# EAGLE design Placa ATMEL 2019 v2.4 (EAGLE 7.6.0)
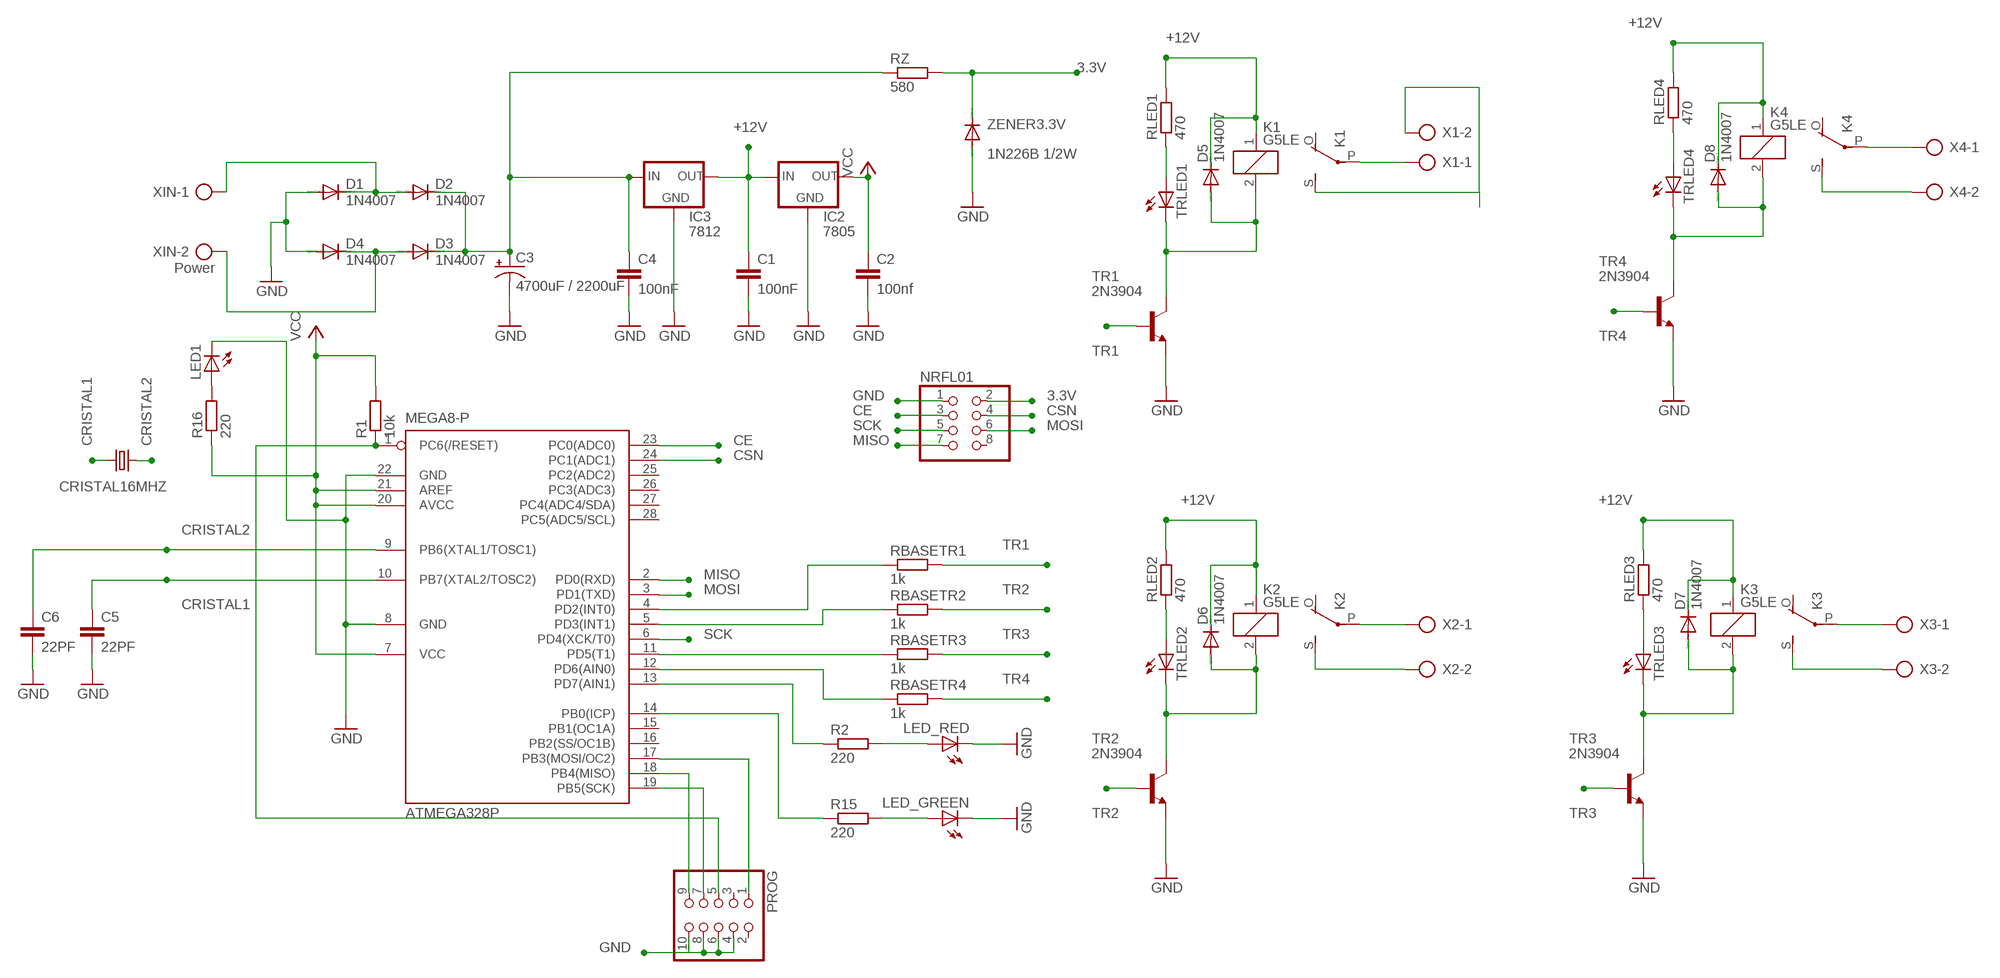
[diagram p0: schematic, sheet 1]

## Parts
ATMEGA328P  MEGA8-P  [DIL28-3]
C1  100nF  C-EU050-025X075  [C050-025X075]
C2  100nf  C-EU050-025X075  [C050-025X075]
C3  4700uF / 2200uF  CPOL-USE7.5-16  [E7,5-16]
C4  100nF  C-EU050-025X075  [C050-025X075]
C5  22PF  C-EU050-024X044  [C050-024X044]
C6  22PF  C-EU050-024X044  [C050-024X044]
CRISTAL16MHZ  CRYSTALHC49S  [HC49/S]
D1  1N4007  1N4004  [DO41-10]
D2  1N4007  1N4004  [DO41-10]
D3  1N4007  1N4004  [DO41-10]
D4  1N4007  1N4004  [DO41-10]
D5  1N4007  1N4004  [DO41-10]
D6  1N4007  1N4004  [DO41-10]
D7  1N4007  1N4004  [DO41-10]
D8  1N4007  1N4004  [DO41-10]
IC2  7805  78XXL  [78XXL]
IC3  7812  78XXL  [78XXL]
K1  G5LE  [G5LE]
K2  G5LE  [G5LE]
K3  G5LE  [G5LE]
K4  G5LE  [G5LE]
LED1  LED5MM  [LED5MM]
LED_GREEN  LED5MM  [LED5MM]
LED_RED  LED5MM  [LED5MM]
NRFL01  PINHD-2X4  [2X04]
PROG  PINHD-2X5  [2X05]
R1  10k  R-EU_0207/10  [0207/10]
R2  220  R-EU_0207/10  [0207/10]
R15  220  R-EU_0207/10  [0207/10]
R16  220  R-EU_0309/10  [0309/10]
RBASETR1  1k  R-EU_0207/10  [0207/10]
RBASETR2  1k  R-EU_0207/10  [0207/10]
RBASETR3  1k  R-EU_0204/7  [0204/7]
RBASETR4  1k  R-EU_0207/15  [0207/15]
RLED1  470  R-EU_0207/10  [0207/10]
RLED2  470  R-EU_0207/10  [0207/10]
RLED3  470  R-EU_0207/10  [0207/10]
RLED4  470  R-EU_0207/10  [0207/10]
RZ  580  R-EU_0207/10  [0207/10]
TR1  2N3904  [TO92]
TR2  2N3904  [TO92]
TR3  2N3904  [TO92]
TR4  2N3904  [TO92]
TRLED1  LED5MM  [LED5MM]
TRLED2  LED5MM  [LED5MM]
TRLED3  LED5MM  [LED5MM]
TRLED4  LED5MM  [LED5MM]
X1  AK300/2  [AK300/2]
X2  AK300/2  [AK300/2]
X3  AK300/2  [AK300/2]
X4  AK300/2  [AK300/2]
XIN  Power  AK500/2  [AK500/2]
ZENER3.3V  1N226B 1/2W  1N4148DO35-10  [DO35-10]

## Nets
3.3V: NRFL01.2 RZ.2 ZENER3.3V.C
+12V: C1.1 D5.C D6.C D7.C D8.C IC2.IN IC3.OUT K1.1 K2.1 K3.1 K4.1 RLED1.2 RLED2.2 RLED3.2 RLED4.2
CE: ATMEGA328P.23(PC0(ADC0)) NRFL01.3
CRISTAL1: ATMEGA328P.10(PB7(XTAL2/TOSC2)) C5.1 CRISTAL16MHZ.2
CRISTAL2: ATMEGA328P.9(PB6(XTAL1/TOSC1)) C6.1 CRISTAL16MHZ.1
CSN: ATMEGA328P.24(PC1(ADC1)) NRFL01.4
GND: ATMEGA328P.8(GND) ATMEGA328P.22(GND) C1.2 C2.2 C3.- C4.2 C5.2 C6.2 D1.A D4.A IC2.GND IC3.GND LED1.K(C) LED_GREEN.K(C) LED_RED.K(C) NRFL01.1 PROG.4 PROG.6 PROG.8 PROG.10 TR1.3(E) TR2.3(E) TR3.3(E) TR4.3(E) ZENER3.3V.A
MISO: ATMEGA328P.2(PD0(RXD)) NRFL01.7
MOSI: ATMEGA328P.3(PD1(TXD)) NRFL01.6
N$1: ATMEGA328P.1(PC6(/RESET)) PROG.5 R1.1
N$2: LED_RED.A R2.2
N$3: ATMEGA328P.14(PB0(ICP)) R15.1
N$4: ATMEGA328P.13(PD7(AIN1)) R2.1
N$6: RLED1.1 TRLED1.A
N$7: ATMEGA328P.4(PD2(INT0)) RBASETR1.1
N$8: ATMEGA328P.5(PD3(INT1)) RBASETR2.1
N$10: ATMEGA328P.11(PD5(T1)) RBASETR3.1
N$12: ATMEGA328P.12(PD6(AIN0)) RBASETR4.1
N$16: ATMEGA328P.17(PB3(MOSI/OC2)) PROG.1
N$17: LED1.A R16.2
N$18: ATMEGA328P.19(PB5(SCK)) PROG.7
N$19: ATMEGA328P.18(PB4(MISO)) PROG.9
N$22: C3.+ C4.1 D2.C D3.C IC3.IN RZ.1
N$24: D1.C D2.A XIN.1
N$29: D5.A K1.2 TR1.1(C) TRLED1.K(C)
N$31: K1.S(2:S) X1.2
N$32: K1.P(2:P) X1.1
N$65: D3.A D4.C XIN.2
N$71: RLED2.1 TRLED2.A
N$81: D6.A K2.2 TR2.1(C) TRLED2.K(C)
N$83: K2.S(2:S) X2.2
N$84: K2.P(2:P) X2.1
N$85: RLED3.1 TRLED3.A
N$86: D7.A K3.2 TR3.1(C) TRLED3.K(C)
N$88: K3.S(2:S) X3.2
N$89: K3.P(2:P) X3.1
N$118: RLED4.1 TRLED4.A
N$138: D8.A K4.2 TR4.1(C) TRLED4.K(C)
N$147: K4.S(2:S) X4.2
N$148: K4.P(2:P) X4.1
N$153: LED_GREEN.A R15.2
SCK: ATMEGA328P.6(PD4(XCK/T0)) NRFL01.5
TR1: RBASETR1.2 TR1.2(B)
TR2: RBASETR2.2 TR2.2(B)
TR3: RBASETR3.2 TR3.2(B)
TR4: RBASETR4.2 TR4.2(B)
VCC: ATMEGA328P.7(VCC) ATMEGA328P.20(AVCC) ATMEGA328P.21(AREF) C2.1 IC2.OUT R1.2 R16.1
Unconnected: ATMEGA328P.15(PB1(OC1A)) ATMEGA328P.16(PB2(SS/OC1B)) ATMEGA328P.25(PC2(ADC2)) ATMEGA328P.26(PC3(ADC3)) ATMEGA328P.27(PC4(ADC4/SDA)) ATMEGA328P.28(PC5(ADC5/SCL)) K1.O(2:O) K2.O(2:O) K3.O(2:O) K4.O(2:O) NRFL01.8 PROG.2 PROG.3

## Library data of the parts
ATMEGA328P = atmel:MEGA8-P: MICROCONTROLLER 8 Kbytes FLASH, 1 kbytes SRAM, 512 bytes EEPROM, USART, 4-channel 10 bit ADC, 2-channel 8 bit ADC Pin compatible with Atmega48, ATMega88, ATMega168 Source: avr.lbr; OC_FARNELL: unknown; OC_NEWARK: unknown
C1 C2 C4-C6 = rcl:C-EU: CAPACITOR, European symbol
C3 = rcl:CPOL-US: POLARIZED CAPACITOR, American symbol
CRISTAL16MHZ = crystal:CRYSTAL: CRYSTAL; OC_FARNELL: 1667008; OC_NEWARK: unknown
D1-D8 = diode:1N4004: DIODE general purpose rectifier, 1 A
IC2 IC3 = v-reg:78XXL: VOLTAGE REGULATOR
K1-K4 = relay:G5LE: RELAY 1 x switch, 10 A/120 V AC, 8 A/30 V DC, Omron; OC_FARNELL: unknown; OC_NEWARK: unknown
LED1 LED_GREEN LED_RED TRLED1-TRLED4 = led:LED: LED OSRAM: - CHIPLED LG R971, LG N971, LY N971, LG Q971, LY Q971, LO R971, LY R971 LH N974, LH R974 LS Q976, LO Q976, LY Q976 LO Q996 - Hyper CHIPLED LW Q18S LB Q993, LB Q99A, LB R99A - SideLED LS A670, LO A670, LY A670, LG A670, LP A670 LB A673, LV A673, LT A673, LW A673 LH A674 LY A675 LS A676, LA A676, LO A676, LY A676, LW A676 LS A679, LY A679, LG A679 - Hyper Micro SIDELED® LS Y876, LA Y876, LO Y876, LY Y876 LT Y87S - SmartLED LW L88C, LW L88S LB L89C, LB L89S, LG L890 LS L89K, LO L89K, LY L89K LS L896, LA L896, LO L896, LY L896 - TOPLED LS T670, LO T670, LY T670, LG T670, LP T670 LSG T670, LSP T670, LSY T670, LOP T670, LYG T670 LG T671, LOG T671, LSG T671 LB T673, LV T673, LT T673, LW T673 LH T674 LS T676, LA T676, LO T676, LY T676, LB T676, LH T676, LSB T676, LW T676 LB T67C, LV T67C, LT T67C, LS T67K, LO T67K, LY T67K, LW E67C LS E67B, LA E67B, LO E67B, LY E67B, LB E67C, LV E67C, LT E67C LW T67C LS T679, LY T679, LG T679 LS T770, LO T770, LY T770, LG T770, LP T770 LB T773, LV T773, LT T773, LW T773 LH T774 LS E675, LA E675, LY E675, LS T675 LS T776, LA T776, LO T776, LY T776, LB T776 LHGB T686 LT T68C, LB T68C - Hyper Mini TOPLED® LB M676 - Mini TOPLED Santana® LG M470 LS M47K, LO M47K, LY M47K Source: http://www.osram.convergy.de LUXEON: - LUMILED® LXK2-PW12-R00, LXK2-PW12-S00, LXK2-PW14-U00, LXK2-PW14-V00 LXK2-PM12-R00, LXK2-PM12-S00, LXK2-PM14-U00 LXK2-PE12-Q00, LXK2-PE12-R00, LXK2-PE12-S00, LXK2-PE14-T00, LXK2-PE14-U00 LXK2-PB12-K00, LXK2-PB12-L00, LXK2-PB12-M00, LXK2-PB14-N00, LXK2-PB14-P00, LXK2-PB14-Q00 LXK2-PR12-L00, LXK2-PR12-M00, LXK2-PR14-Q00, LXK2-PR14-R00 LXK2-PD12-Q00, LXK2-PD12-R00, LXK2-PD12-S00 LXK2-PH12-R00, LXK2-PH12-S00 LXK2-PL12-P00, LXK2-PL12-Q00, LXK2-PL12-R00 Source: www.luxeon.com KINGBRIGHT: KA-3528ASYC Source: www.kingbright.com
NRFL01 = pinhead:PINHD-2X4: PIN HEADER
PROG = pinhead:PINHD-2X5: PIN HEADER
R1 R2 R15 R16 RBASETR1-RBASETR4 RLED1-RLED4 RZ = rcl:R-EU_: RESISTOR, European symbol
TR1-TR4 = transistor-npn:2N3904: NPN Transistor
X1-X4 = con-ptr500:AK300/2: CONNECTOR; OC_FARNELL: unknown; OC_NEWARK: unknown
XIN = con-ptr500:AK500/2: CONNECTOR; OC_FARNELL: unknown; OC_NEWARK: unknown
ZENER3.3V = diode:1N4148: DIODE high speed (Philips)

## Board
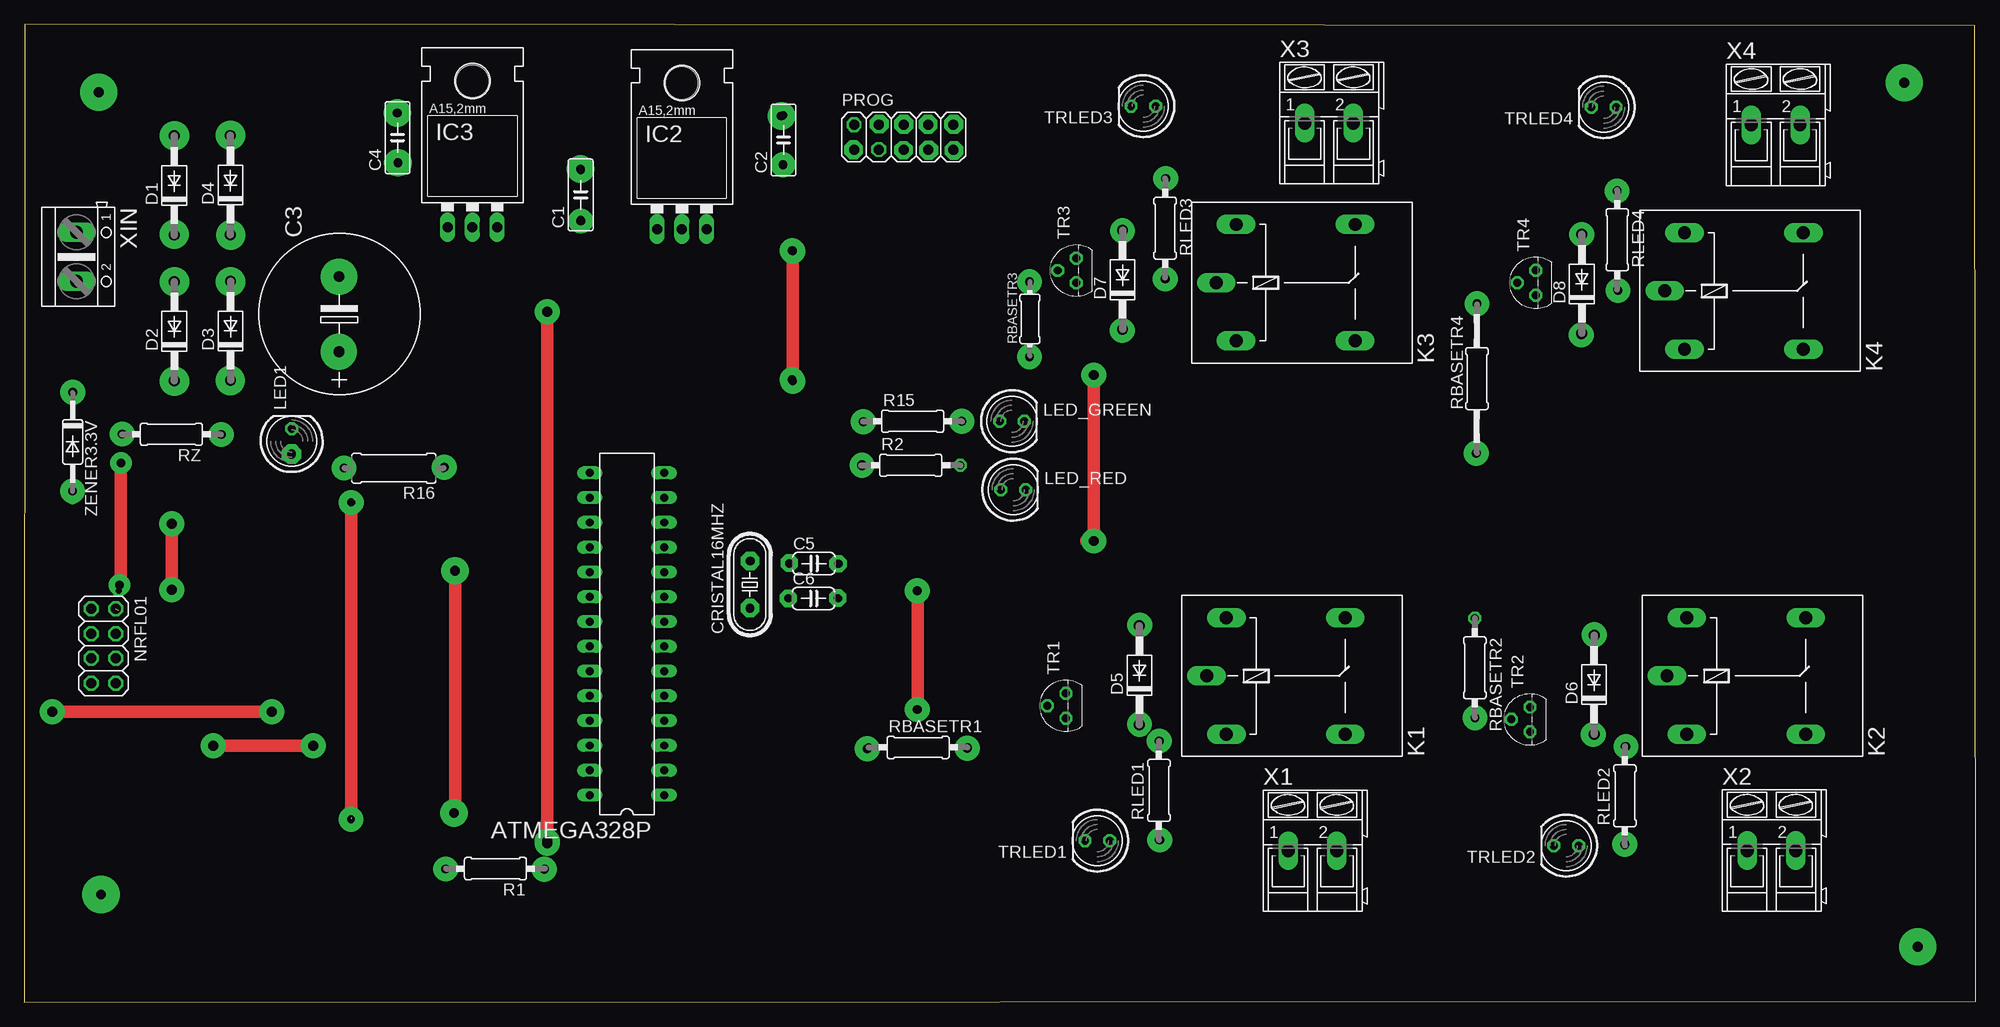
[diagram p1: board, top side]
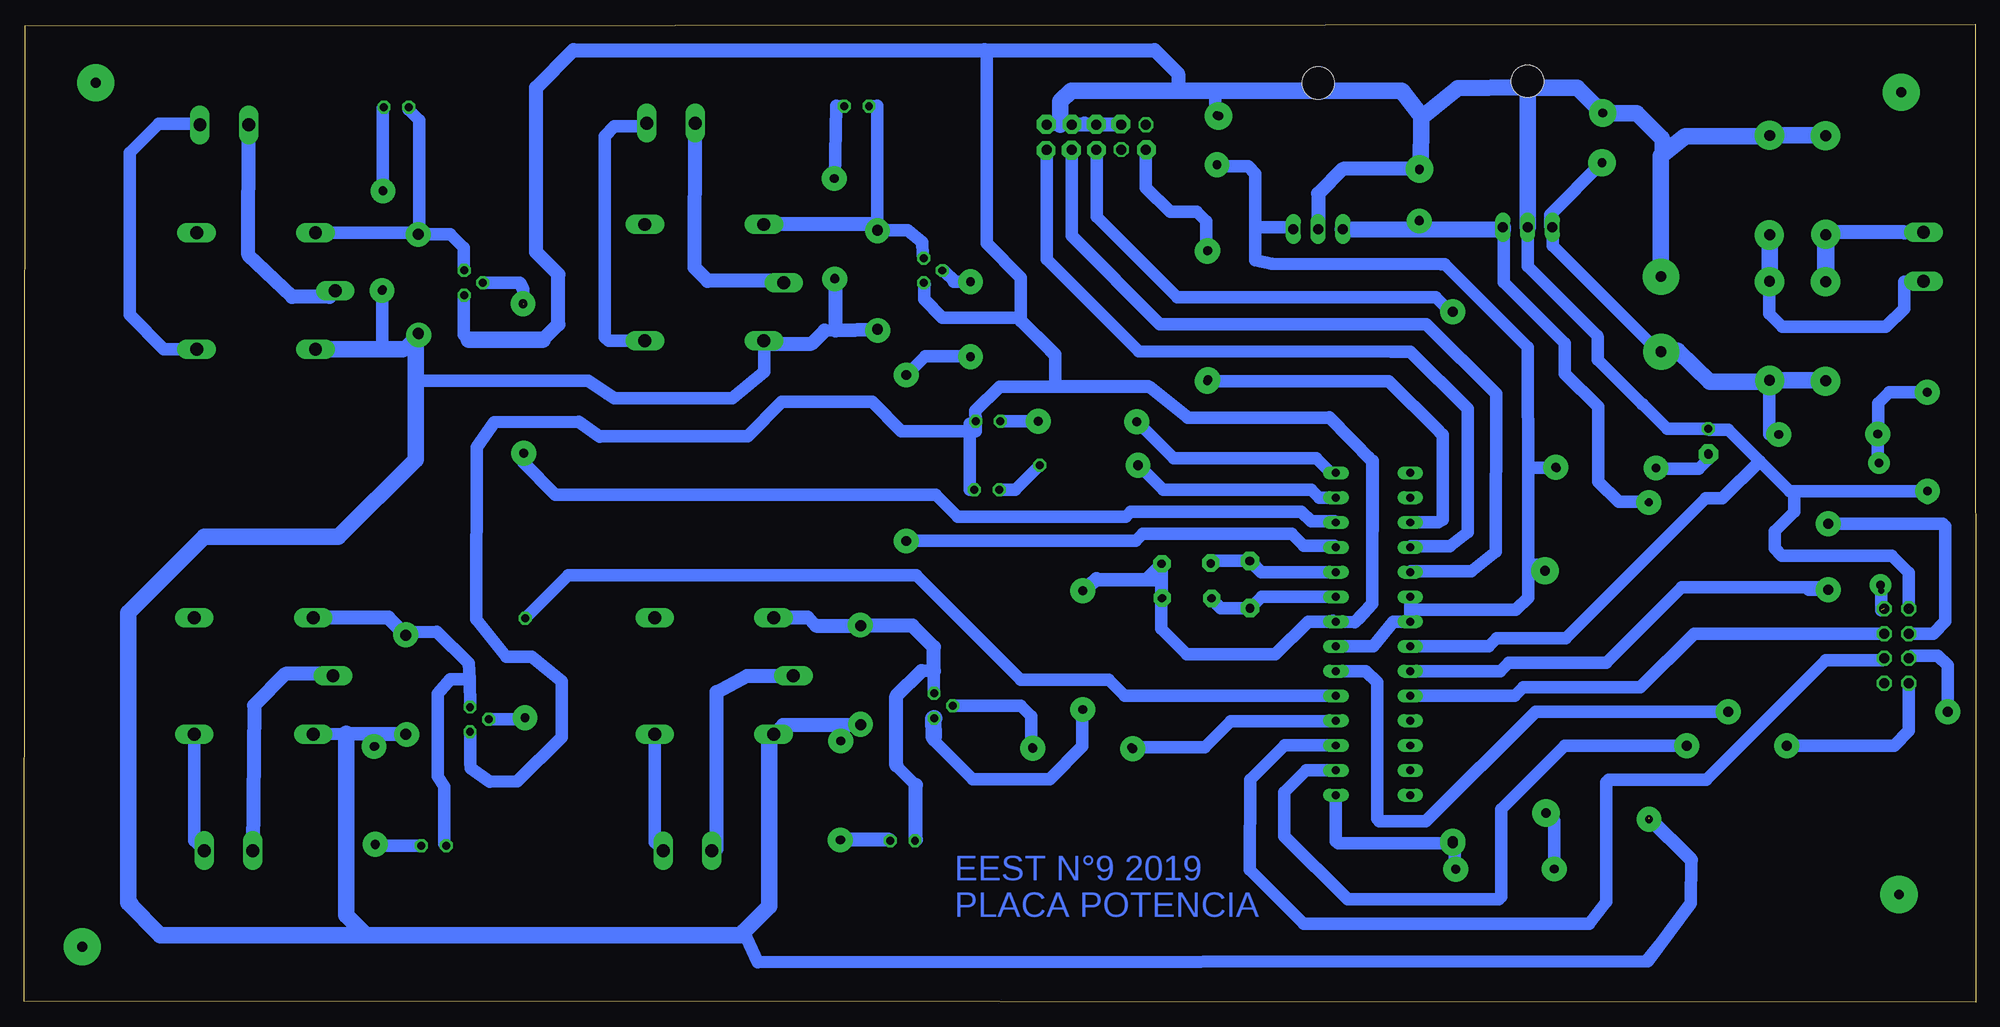
[diagram p2: board, bottom side, seen from below]

Size 200.02 x 100.24 mm. Coordinates in mm from the lower left corner, seen from the top.
Outline: 0,0 200.02,0.11 199.92,100.08 0.04,100.24 0,0
Copper layers (1*16): Top 0.035mm / dielectric 1.5mm / Bottom 0.035mm
Design rules "default *": minimum track width 10mil, minimum drill 1mm, track to track 1mm, track to pad 1mm, pad to pad 1mm, via to via 1mm, smd to smd 1mm, copper to edge 1mm, drill to drill 1mm, minimum pad ring 10mil, minimum via ring 8mil, stop-mask expansion 4mil, vias tented up to drill 0mil, thermal gap 10mil

### Footprints (pad centres in the part's own frame; a part is rotated, then mirrored left to right if it is on the bottom)
DIL28-3 = drill 0.813 long: 1 -16.51,-3.81; 2 -13.97,-3.81; 3 -11.43,-3.81; 4 -8.89,-3.81; 5 -6.35,-3.81; 6 -3.81,-3.81; 7 -1.27,-3.81; 8 1.27,-3.81; 9 3.81,-3.81; 10 6.35,-3.81; 11 8.89,-3.81; 12 11.43,-3.81; 13 13.97,-3.81; 14 16.51,-3.81; 15 16.51,3.81; 16 13.97,3.81; 17 11.43,3.81; 18 8.89,3.81; 19 6.35,3.81; 20 3.81,3.81; 21 1.27,3.81; 22 -1.27,3.81; 23 -3.81,3.81; 24 -6.35,3.81; 25 -8.89,3.81; 26 -11.43,3.81; 27 -13.97,3.81; 28 -16.51,3.81
C050-025X075 = drill 0.813 octagon: 1 -2.54,0; 2 2.54,0
E7,5-16 = drill 1.016 pad 3.15: + -3.81,0 | drill 1.016 pad 3.15 octagon: - 3.81,0
C050-024X044 = drill 0.813 octagon: 1 -2.54,0; 2 2.54,0
HC49/S = drill 0.813: 1 -2.413,0; 2 2.413,0
DO41-10 = drill 1.118: A 5.08,0; C -5.08,0
78XXL = drill 1.016 long: GND 0,-3.81; IN -2.54,-3.81; OUT 2.54,-3.81 | hole 3.302: 0,11.176
G5LE = drill 1.321 long: 1 -7.493,-5.969; 2 -7.493,5.969; O 4.699,5.969; P -9.525,0; S 4.699,-5.969
LED5MM = drill 0.813 octagon: A -1.27,0; K 1.27,0
2X04 = drill 1.016 octagon: 1 -3.81,-1.27; 2 -3.81,1.27; 3 -1.27,-1.27; 4 -1.27,1.27; 5 1.27,-1.27; 6 1.27,1.27; 7 3.81,-1.27; 8 3.81,1.27
2X05 = drill 1.016 octagon: 1 -5.08,-1.27; 2 -5.08,1.27; 3 -2.54,-1.27; 4 -2.54,1.27; 5 0,-1.27; 6 0,1.27; 7 2.54,-1.27; 8 2.54,1.27; 9 5.08,-1.27; 10 5.08,1.27
0207/10 = drill 0.813 octagon: 1 -5.08,0; 2 5.08,0
0309/10 = drill 0.813 octagon: 1 -5.08,0; 2 5.08,0
0204/7 = drill 0.813 octagon: 1 -3.81,0; 2 3.81,0
0207/15 = drill 0.813 octagon: 1 -7.62,0; 2 7.62,0
TO92 = drill 0.813 octagon: 1 1.27,0; 2 0,1.905; 3 -1.27,0
AK300/2 = drill 1.321 long: 1 -2.515,0; 2 2.489,0
AK500/2 = drill 1.321 long: 1 -2.515,0; 2 2.515,0
DO35-10 = drill 0.813 long: A 5.08,0; C -5.08,0

### Placement (x,y rotation side)
ATMEGA328P  61.77,37.75 90 top
C1  57.02,82.76 90 top
C2  77.82,88.39 90 top
C3  32.29,70.54 90 top
C4  38.25,88.63 90 top
C5  80.94,44.97 0 top
C6  80.89,41.39 0 top
CRISTAL16MHZ  74.37,42.82 90 top
D1  15.36,83.73 90 top
D2  15.37,68.79 90 top
D3  21.13,68.82 90 top
D4  21.12,83.77 90 top
D5  114.3,33.52 90 top
D6  160.91,32.56 90 top
D7  112.57,74.06 90 top
D8  159.65,73.64 90 top
IC2  67.4,83.06 0 top
IC3  45.93,83.25 0 top
K1  130.71,33.46 0 top
K2  177.91,33.46 0 top
K3  131.71,73.76 0 top
K4  177.67,72.92 0 top
LED1  27.4,57.53 90 top
LED_GREEN  101.24,59.56 0 top
LED_RED  101.36,52.54 0 top
NRFL01  8.11,36.52 270 top
PROG  90.13,88.68 0 top
R1  48.29,13.7 180 top
R2  90.86,55.04 0 top
R15  91.05,59.55 0 top
R16  37.87,54.74 180 top
RBASETR1  91.62,26.12 0 top
RBASETR2  148.69,34.29 270 top
RBASETR3  103.07,70.05 90 top
RBASETR4  148.9,63.93 90 top
RLED1  116.3,21.72 90 top
RLED2  164.07,21.17 90 top
RLED3  116.93,79.35 270 top
RLED4  163.28,78.16 270 top
RZ  15.07,58.22 180 top
TR1  106.77,30.39 90 top
TR2  154.34,28.99 90 top
TR3  107.82,75.01 90 top
TR4  154.94,73.75 90 top
TRLED1  109.99,16.57 180 top
TRLED2  158.05,16.06 180 top
TRLED3  114.71,91.86 180 top
TRLED4  161.89,91.76 180 top
X1  132.06,15.53 0 top
X2  179.11,15.54 0 top
X3  133.75,90.12 0 top
X4  179.53,89.94 0 top
XIN  5.34,76.41 270 top
ZENER3.3V  4.95,57.45 270 top

### Tracks (layer width: path | path; a pad name or v marks a point on that pad's centre or on a via)
3.3V  (via drill 0.6, 0.9 pad 2.54)  (1 unrouted)
  Top 1.27: v9.66,42.2 9.89,42.57 v9.89,55.24
  Bottom 1.27: 9.66,40.19 v9.66,42.2 | v9.89,55.24 10.07,55.24 RZ.2 9.99,61.38 8.84,62.53 v4.96,62.53 ZENER3.3V.C
+12V  (via drill 0.8 pad 2.54)  (1 unrouted)
  Top 1.27: v33.51,51.23 33.51,18.8 33.45,18.74
  Bottom 0.305: 127,6.59 127.17,6.17
  Bottom 0.406: D7.C 115.48,68.98 115.48,68.66 117.05,68.66 117.05,69.08 117.88,69.08 119.47,67.49 124.21,67.49 124.3,67.58 124.3,64.82 124.2,64.72 124.59,64.72 127.5,61.81 139.33,61.81 139.53,62.01 140.51,62.01 142.14,63.64 159.92,63.64 160.13,63.43 160.13,55.33 167.8,47.66 181.76,47.41 181.62,47.55 181.98,47.3 189.25,39.78 189.5,13.39 189.14,10.05 188.89,9.77 185.36,6.57 127.1,6.69 127,6.59
  Bottom 1.27: C1.1 57.21,79.17 | 123.94,67.51 K3.1 124.16,67.73 124.16,64.62 127.45,61.89 139.54,61.89 142.21,63.72 159.92,63.72 | 117.98,68.86 116.9,68.88 | K1.1 122.27,28.44 | RLED3.2 116.9,73.17 | 161.26,66.95 D8.C 159.92,68.29 | RLED4.2 163.32,73.04 163.32,66.95 | RLED1.2 116.27,26.83 116.27,28.44 | D6.C 160.92,27.49 | 167.03,27.53 K2.1 | RLED2.2 164.26,26.44 164.26,27.49 | v33.51,51.23 34.32,51.29 36.6,51.29 38.66,53.35 38.66,57.09 38.68,57.35 38.68,61.03 42.11,64.45 42.11,67.54 48.36,73.79 48.36,78.72 49.17,79.17 | 29.16,14.6 29.19,10.16 33.63,4.2 32.43,5.82 33.74,4.18 124.82,4.1 126.3,7.22
  Bottom 1.422: 48.45,79.17 49.17,79.17 | 57.21,79.17 49.17,79.17 | 49.17,79.17 48.47,79.47 | 123.94,67.51 119.33,67.51 117.98,68.86 | D7.C 116.9,68.88 116.9,73.17 | 122.27,28.44 116.27,28.44 D5.C | 160.92,27.49 164.26,27.49 167.03,27.53 | K1.1 123.66,27.05 | 29.16,14.6 33.53,18.93
  Bottom 1.676: IC2.IN 48.45,79.17 | 48.47,79.47 IC3.OUT | 161.26,66.95 163.32,66.95 K4.1 | 123.66,27.05 123.66,9.86 126.3,7.22 126.65,6.87 164.96,6.87 | 164.96,6.87 167.03,8.94 167.03,27.53 | 159.92,68.29 159.92,63.72 159.92,55.62 167.83,47.71 181.6,47.71 189.39,39.92 189.39,10.18 | 189.14,10.05 189.39,10.18 | 189.39,10.18 186.08,6.87 164.96,6.87
CE  (via drill 1 pad 2.54)
  Top 1.27: v15.11,42.29 v15.11,49.04
  Bottom 1.27: v15.11,49.04 3.36,49.04 3.11,48.79 3.11,39.04 4.36,37.79 NRFL01.3 | v15.11,42.29 15.61,42.29 | 15.61,42.29 17.11,42.29 | ATMEGA328P.23 48.71,33.94 47.86,34.79 37.86,34.79 30.11,42.54 15.86,42.54 15.61,42.29
CRISTAL1
  Bottom 1.27: ATMEGA328P.10 73.24,44.1 CRISTAL16MHZ.2 78.14,45.23 C5.1
CRISTAL2
  Bottom 1.27: C6.1 77.37,40.41 CRISTAL16MHZ.1 73.2,41.58 73.18,41.58 ATMEGA328P.9
CSN
  Bottom 1.27: ATMEGA328P.24 47.25,31.4 46.36,32.29 34.36,32.29 28.86,37.79 16.61,37.79 16.11,37.79 NRFL01.4
GND  (via drill 0.6)  (1 unrouted)
  Top 1.27: v91.58,30.02 v91.58,42.18
  Bottom 1.27: 61.83,40.86 63.62,38.94 65.83,38.98 65.88,39.12 ATMEGA328P.8 68.43,39.03 71.8,35.66 80.86,35.66 83.47,38.27 83.47,43.04 83.69,43.26 90.21,43.26 91.29,42.18 v91.58,42.18 | 61.83,40.86 63.26,39.32 | 61.83,40.86 61.84,55.47 66.26,59.95 76.45,59.91 80.76,59.91 84.83,63.14 94.46,63.13 94.36,63.37 | LED_GREEN.K 102.51,58.54 110.11,58.54 113.11,61.54 122.36,61.54 125.86,58.04 140.98,58.04 141.04,57.98 143.17,59.49 151.84,59.46 153.65,56.88 153.68,39.27 150.62,35.43 148,35.43 144.96,32.91 144.96,27.18 149.48,22.66 152.33,22.62 154.27,24.01 154.32,24.57 154.32,27.72 TR2.3 | C2.2 77.92,91.03 77.92,93.18 78.2,93.46 | 56.87,85.33 C1.2 57.15,85.43 | 46.36,93.77 45.93,93.34 | TR3.3 107.7,73.62 107.78,73.54 107.78,72.04 105.93,70.19 98.13,70.19 94.36,66.42 94.36,63.37 | 94.36,63.37 94.61,63.09 100.03,63.11 102.54,60.63 LED_GREEN.K | TR4.3 154.99,72.43 154.99,68.41 154.47,67.89 | TR1.3 106.78,26.84 102.82,22.88 94.93,22.88 91.58,26.23 v91.58,30.02 | IC3.GND 45.89,79.4 45.89,75.44 38.77,68.32 38.74,68.15 38.71,68.15 38.71,65.84 34.17,61.3 34.11,61.3 31.61,58.8 LED1.K 27.29,58.69 25.36,58.69 22.14,55.47 | 22.14,55.47 19.04,52.37 ZENER3.3V.A 18.28,52.37 18.61,52.04 18.61,50.29 20.61,48.29 20.61,46.54 19.86,45.79 8.61,45.79 6.86,44.04 6.86,40.35 | 22.14,55.47 25.96,51.65 27.68,51.65 42.04,37.29 49.11,37.29 49.92,36.48 ATMEGA328P.22 | 61.83,40.86 61.82,55.51 61.83,52.91 61.83,52.14 61.86,55.5 62.19,55.88 66.27,59.94 80.73,59.92 84.61,63.04 96.3,63.11 94.33,63.14 94.34,66.29 94.59,66.54 94.86,66.79 97.86,69.79 97.86,74.29 101.36,77.79 101.36,97.34 101.61,97.59
  Bottom 1.27: 95.31,89.85 PROG.10 93.84,89.95 | LED_RED.K 103.11,52.54 103.11,58.84 | 103.11,58.84 103.11,59.29 | PROG.8 93.7,89.95 93.84,90.09 | LED_GREEN.K 102.51,59.44 103.11,58.84 | 90.1,43.38 85.07,43.38 C5.2 83.43,44.92 C6.2
  Bottom 1.422: 32.16,88.56 32.3,86.78 | 45.97,79.08 IC3.GND | 46.54,93.78 46.36,93.77 | 57.15,85.43 64.87,85.43 67.4,82.9 IC2.GND | 81.76,93.46 81.76,95.18 84.17,97.59 101.61,97.59 143.74,97.59 147.56,93.77 147.56,76.89 145.28,74.61 145.28,69.5 146.89,67.89 | v91.58,42.18 90.1,43.38 | PROG.4 PROG.6 PROG.8
  Bottom 1.676: D1.A 15.4,88.85 D4.A 21.22,88.75 29.75,88.75 32.3,86.78 C3.- | 32.16,88.56 34.76,91.12 38.07,91.12 C4.2 40.85,93.77 46.36,93.77 | 93.84,89.95 93.84,90.09 93.84,92.35 92.73,93.46 81.76,93.46 78.2,93.46 58.83,93.46 57.08,91.18 56.85,90.66 | 56.87,85.33 56.85,90.66 | 56.85,90.66 53.08,93.71 46.54,93.78 | 45.93,93.34 IC3.GND | 154.47,67.89 146.89,67.89 | TR1.3 106.83,29.06 106.81,27.23
MISO  (via drill 1 pad 2.54)
  Top 1.27: v19.36,26.29 v29.61,26.29
  Bottom 1.27: NRFL01.7 6.84,27.81 8.36,26.29 v19.36,26.29 | v29.61,26.29 42.11,26.29 48.61,19.79 48.61,10.79 48.86,10.54 64.36,10.54 70.86,17.04 70.86,21.54 68.61,23.79 ATMEGA328P.2
MOSI
  Bottom 1.27: ATMEGA328P.3 70.83,26.32 74.36,22.79 74.41,13.56 68.86,8.04 39.61,8.04 37.86,10.29 37.86,22.54 37.61,22.79 27.61,22.79 15.36,35.04 9.59,35.04 NRFL01.6
N$1  (via drill 1 pad 2.54)
  Top 1.27: v53.61,16.29 v53.61,16.54 v53.61,70.79
  Bottom 1.27: 65.11,16.29 65.36,16.29 65.58,16.51 ATMEGA328P.1 65.58,16.76 65.11,16.29 | 53.86,16.29 v53.61,16.29 53.37,16.05 R1.1 | v53.61,70.79 53.86,70.79 55.36,72.29 81.86,72.29 90.11,80.54 90.11,87.39 PROG.5 | 65.11,16.29 53.86,16.29 | 53.86,16.29 v53.61,16.54
N$2
  Bottom 1.27: LED_RED.A 98.44,52.54 R2.2
N$3
  Bottom 1.27: ATMEGA328P.14 66.08,54.26 67.61,55.79 82.21,55.79 R15.1
N$4
  Bottom 1.27: ATMEGA328P.13 67.29,51.72 68.11,52.54 83.28,52.54 R2.1
N$5  (via drill 1 pad 2.54)
  other vias: 85.86,55.04
N$6
  Bottom 1.27: TRLED1.A 111.33,16.64
  Bottom 1.422: 111.33,16.64 RLED1.1
N$7
  Bottom 1.27: RBASETR1.1 79.03,26.12 76.36,28.79 65.65,28.79 ATMEGA328P.4
N$8
  Bottom 1.27: ATMEGA328P.5 87.22,31.4 88.86,33.04 97.86,33.04 108.61,43.79 144.27,43.79 RBASETR2.1
N$10  (via drill 1 pad 2.54)
  Top 1.27: v109.61,64.29 109.61,48.04 108.86,47.29 v109.61,47.29
  Bottom 1.27: ATMEGA328P.11 65.73,46.79 68.86,46.79 70.11,48.04 85.36,48.04 86.11,47.29 v109.61,47.29 | RBASETR3.1 107.66,66.24 v109.61,64.29
N$12
  Bottom 1.27: RBASETR4.1 148.9,55.33 145.61,52.04 106.61,52.04 104.36,49.79 87.11,49.79 86.61,50.29 69.11,50.29 68.11,49.29 65.69,49.29 ATMEGA328P.12
N$16  (via drill 0.8 pad 2.54)
  Top 1.27: v78.77,76.98 v78.77,63.67
  Bottom 1.27: PROG.1 85.05,83.5 82.56,81.01 79.84,81.01 78.89,80.06 78.89,77.1 v78.77,76.98 | v78.77,63.67 60.14,63.67 55.16,58.69 54.81,58.34 54.62,58.15 54.62,49.44 55.09,49.22 57.92,49.22 ATMEGA328P.17
N$17
  Bottom 1.27: LED1.A 27.4,55.68 28.37,54.71 32.76,54.71 R16.2
N$18
  Bottom 1.27: ATMEGA328P.19 57.88,44.18 51.72,44.18 49.18,46.2 49.16,62.38 56.3,69.52 83.61,69.52 92.67,78.58 PROG.7
N$19
  Bottom 1.27: ATMEGA328P.18 57.88,46.72 53.89,46.72 52.07,48.19 52.06,60.82 57.93,66.69 59.9,66.69 85.8,66.73 95.21,76.14 PROG.9
N$22
  Bottom 1.27: RZ.1 21.13,58.22 D3.C | C3.+ 32.55,66.73 43.36,77.54 43.36,79.41 IC3.IN 43.51,79.44 43.61,79.54 43.61,80.73 C4.1
  Bottom 1.676: D2.C 15.4,63.74 D3.C 21.28,63.59 27.26,63.59 30.51,66.78 C3.+
N$23  (via drill 0.9 pad 2)
  other vias: 27.39,56.18
N$24
  Bottom 1.27: XIN.1 7.28,78.92 | 15.03,78.65 D1.C
  Bottom 1.422: 7.28,78.92 15.36,78.92 D1.C
  Bottom 1.8: D1.C D2.A
N$28  (via drill 0.9 pad 2.18)
  other vias: 9.9,55.28
N$29
  Bottom 1.27: K1.2 123.2,39.45 | 119.74,39.45 118.89,38.6 | TR1.1 106.8,31.69 106.8,33.98 108.04,33.98 | TRLED1.K 108.63,16.66 | 108.63,22.26 110.62,24.25
  Bottom 1.422: 123.2,39.45 119.74,39.45 | 118.89,38.6 D5.A 108.99,38.6 106.8,36.41 106.8,33.98 | 108.63,16.66 108.63,22.26 | 110.62,24.25 110.62,31.4 108.04,33.98
N$30  (via drill 0.9 pad 2.54)
  other vias: 77.76,85.84
N$31
  Bottom 1.27: X1.2 135.41,16.39 K1.S
N$32
  Bottom 1.422: X1.1 129.05,15.68 129.05,31.79 125.94,33.46 K1.P
N$33  (via drill 0.9 pad 2.18)
  other vias: 9.75,42.77
N$41  (via drill 1 pad 3.81)
  other vias: 7.61,93.29
N$43  (via drill 0.9 pad 1.93)
  other vias: 92.63,90
N$44  (via drill 0.9 pad 2.54)
  other vias: 96.65,26.04
N$46  (via drill 0.9 pad 2.54)
  other vias: 43.18,13.65
N$47  (via drill 0.9 pad 2.54)
  other vias: 53.3,13.64
N$52  (via drill 0.9 pad 2.54)
  other vias: 78.69,63.84
N$55  (via drill 0.9 pad 1.93)
  other vias: 95.29,87.31
N$56  (via drill 0.9 pad 1.93)
  other vias: 85,87.38
N$59  (via drill 0.9 pad 1.93)
  other vias: 92.69,87.33
N$60  (via drill 0.9 pad 1.93)
  other vias: 90.13,90
N$61  (via drill 0.9 pad 1.93)
  other vias: 95.26,90
N$63  (via drill 0.9 pad 2.54)
  other vias: 86.41,25.99
N$64  (via drill 0.9 pad 1.85)
  other vias: 90.12,87.35
N$65
  Bottom 1.27: XIN.2 7.32,73.84 7.32,71.07 9.23,69.25 19.82,69.25 21.13,70.56 D3.A
  Bottom 1.7: D3.A D4.C
N$66  (via drill 0.9 pad 2.54)
  other vias: 78.72,77.07
N$71
  Bottom 1.27: RLED2.1 164.04,16.06 TRLED2.A
N$78  (via drill 0.9 pad 2.54)
  other vias: 148.84,56.27
N$79  (via drill 0.9 pad 2.54)
  other vias: 117.01,84.44
N$81
  Bottom 1.27: D6.A 160.61,37.94 157.75,37.99 154.47,34.76 154.39,33.11 | 154.39,33.11 TR2.1 | TRLED2.K 156.98,16.26 156.98,22.07 157.66,23.15 157.66,31.6 156.35,33.09 154.39,33.11
  Bottom 1.422: D6.A 162.7,39.43 K2.2
N$83
  Bottom 1.27: X2.2 182.61,16.55 K2.S
N$84
  Bottom 1.27: K2.P 168.58,33.65
  Bottom 1.422: 168.58,33.65 173.27,33.65 176.48,30.45 X2.1
N$85
  Bottom 1.27: TRLED3.A 116.82,91.89 RLED3.1
N$86
  Bottom 1.27: TRLED3.K 112.57,91.9 D7.A | TR3.1 107.93,76.56 108,77.93 109.48,79.14 D7.A | D7.A 113.16,79.73
  Bottom 1.422: 113.16,79.73 K3.2
N$87  (via drill 0.9 pad 2.54)
  other vias: 116.95,74.15
N$88
  Bottom 1.27: X3.2 136.57,89.79 139.53,89.79 140.53,88.79 140.53,68.19 140.13,67.79 K3.S
N$89
  Bottom 1.27: K3.P 122.39,73.96
  Bottom 1.422: 122.39,73.96 129.98,73.96 131.33,75.31 X3.1
N$90  (via drill 0.9 pad 2.54)
  other vias: 112.57,79.09
N$91  (via drill 0.9 pad 2.54)
  other vias: 112.53,68.87
N$93  (via drill 0.9 pad 2.54)
  other vias: 103.03,73.86
N$96  (via drill 1 pad 2.8)
  other vias: 44.15,44.23
N$98
  Top 0.813: 78.91,77.11 78.64,76.92 78.68,64.47
N$101  (via drill 1 pad 3)
  other vias: 15.39,88.82
N$102  (via drill 1 pad 3)
  other vias: 21.13,88.87
N$103  (via drill 1 pad 3)
  other vias: 21.16,78.66
N$104  (via drill 1 pad 3)
  other vias: 15.36,78.72
N$105  (via drill 1 pad 3)
  other vias: 21.14,73.85
N$106  (via drill 1 pad 3)
  other vias: 15.39,73.85
N$107  (via drill 1 pad 3)
  other vias: 21.11,63.73
N$108  (via drill 1 pad 3)
  other vias: 15.39,63.66
N$116  (via drill 1 pad 2.8)
  other vias: 44.05,19.39
N$118
  Bottom 1.27: TRLED4.A 163.28,91.64 RLED4.1
N$124  (via drill 0.9 pad 2.8)
  other vias: 38.22,91.15
N$125  (via drill 0.9 pad 2.8)
  other vias: 38.3,86.06
N$126  (via drill 0.9 pad 2.8)
  other vias: 57.01,85.42
N$127  (via drill 0.9 pad 2.8)
  other vias: 77.6,90.86
N$128  (via drill 0.9 pad 2.54)
  other vias: 103.03,66.16
N$130
  Bottom 1.422: 91.34,90.04 91.37,90.07
N$131  (via drill 0.9 pad 1.93)
  other vias: 87.63,90.03
N$132  (via drill 1.1 pad 3.7)
  other vias: 32.24,66.69
N$133  (via drill 1.1 pad 3.7)
  other vias: 32.25,74.39
N$134
  Bottom 1.422: 95.19,90.16 95.22,90.16
N$137  (via drill 0.8 pad 1.78)
  other vias: 78.31,41.4
N$138
  Bottom 1.27: 170.04,79.03 K4.2 159.82,78.89 D8.A | D8.A 159.52,78.85 159.52,90.41 160.62,91.51 TRLED4.K | TR4.1 154.99,75.07 154.99,77.36 156.35,78.72 D8.A
N$139  (via drill 0.9 pad 2.54)
  other vias: 43.04,54.84
N$140  (via drill 0.9 pad 2.54)
  other vias: 32.77,54.77
N$141  (via drill 0.8 pad 1.78)
  other vias: 78.4,45.02
N$142  (via drill 0.8 pad 1.78)
  other vias: 83.4,44.95
N$143  (via drill 0.8 pad 1.78)
  other vias: 83.37,41.44
N$144  (via drill 0.9 pad 2.54)
  other vias: 96.1,59.56
N$145  (via drill 0.9 pad 1.9)
  other vias: 74.4,45.23
N$146  (via drill 0.9 pad 1.9)
  other vias: 74.38,40.4
N$147
  Bottom 1.27: X4.2 182.16,90.08 186.24,90.08 189.24,87.08 189.24,70.48 185.71,66.95 K4.S
N$148
  Bottom 1.27: K4.P 168.76,72.31
  Bottom 1.422: 168.76,72.31 172.58,72.31 177.06,76.59 X4.1
N$150  (via drill 0.9 pad 2.54)
  other vias: 57.04,80.08
N$151  (via drill 0.9 pad 2.54)
  other vias: 85.99,59.52
N$153
  Bottom 1.27: R15.2 97.52,59.56 LED_GREEN.A
N$156  (via drill 0.9 pad 2.54)
  other vias: 116.38,16.64
N$157  (via drill 0.9 pad 2.54)
  other vias: 116.33,26.78
N$158  (via drill 0.9 pad 2.54)
  other vias: 114.31,28.49
N$159  (via drill 0.9 pad 2.54)
  other vias: 114.34,38.67
N$160  (via drill 0.9 pad 2.54)
  other vias: 160.93,37.68
N$161  (via drill 0.9 pad 2.54)
  other vias: 160.81,27.45
N$162  (via drill 0.9 pad 2.54)
  other vias: 164.19,26.21
N$163  (via drill 0.9 pad 2.54)
  other vias: 164.04,16.21
N$164  (via drill 0.9 pad 2.54)
  other vias: 159.65,78.7
N$165  (via drill 0.9 pad 2.54)
  other vias: 159.6,68.41
N$166  (via drill 0.9 pad 2.54)
  other vias: 163.36,72.97
N$167  (via drill 0.9 pad 2.54)
  other vias: 163.25,83.15
N$168  (via drill 0.9 pad 2.54)
  other vias: 148.7,29.16
N$169  (via drill 0.9 pad 2.54)
  other vias: 91.53,30
N$170  (via drill 0.9 pad 2.54)
  other vias: 91.52,42.19
N$171  (via drill 0.9 pad 2.54)
  other vias: 10.04,58.25
N$172  (via drill 0.9 pad 2.54)
  other vias: 20.19,58.21
N$173  (via drill 0.9 pad 2.54)
  other vias: 4.93,52.41
N$174  (via drill 1 pad 3.81)
  other vias: 7.86,11.04
N$175  (via drill 0.8 pad 2.54)
  other vias: 33.48,18.76
N$176  (via drill 0.8 pad 2.54)
  other vias: 33.48,51.24
N$177  (via drill 1 pad 3.81)
  other vias: 194.1,5.7
N$178  (via drill 1 pad 3.81)
  other vias: 192.71,94.27
SCK  (via drill 1 pad 2.54)
  Top 1.27: v25.36,29.79 v2.86,29.79
  Bottom 1.27: ATMEGA328P.6 62.51,33.94 61.36,32.79 61.36,18.79 61.11,18.54 56.36,18.54 45.11,29.79 v25.36,29.79 | v2.86,29.79 2.86,34.54 3.86,35.54 6.55,35.54 NRFL01.5
TR1
  Bottom 1.27: TR1.2 97.87,30.39 96.79,29.31 96.79,26.71 RBASETR1.2
TR2
  Bottom 1.27: RBASETR2.2 148.91,28.99 TR2.2
TR3
  Bottom 1.27: RBASETR3.2 104.61,73.86 | 104.61,73.86 104.77,73.86 | TR3.2 105.76,75.01 104.61,73.86
TR4  (via drill 0.9 pad 2.54)  (1 unrouted)
  Bottom 1.27: v148.9,71.59 148.9,73.09 149.23,73.75 TR4.2
VCC  (via drill 0.6)
  Top 1.27: v44.03,19.42 44.16,19.55 v44.16,44.26
  Bottom 1.27: 57.96,40.22 ATMEGA328P.21 59.68,39.02 61.77,36.51 65.55,36.51 ATMEGA328P.7 | 45.88,52.66 45.92,67.16 54.42,75.66 54.77,75.66 72.13,75.68 73.82,76.07 73.82,79.46 | ATMEGA328P.20 57.96,40.22 | 57.96,40.22 47.16,40.21 45.88,41.49 45.88,44.87 | 45.88,44.87 45.88,52.66 | v44.16,44.26 44.77,44.87 45.88,44.87 | 73.82,79.46 73.82,84.93 74.57,85.68 77.65,85.68 C2.1 77.88,85.79 78.14,85.94 77.76,86.05 | IC2.OUT 70.15,79.46 73.82,79.46 | 45.88,52.66 45.88,54.52 45.61,54.79 43,54.79 R16.1 | R1.2 43.21,18.6 v44.03,19.42

### Text on the board
Bottom: EEST N°9 2019 | PLACA POTENCIA